# Altium schematic sheet Phase Shifting Stage.SchDoc
size A4; SheetNumber: 3; SheetTotal: 7
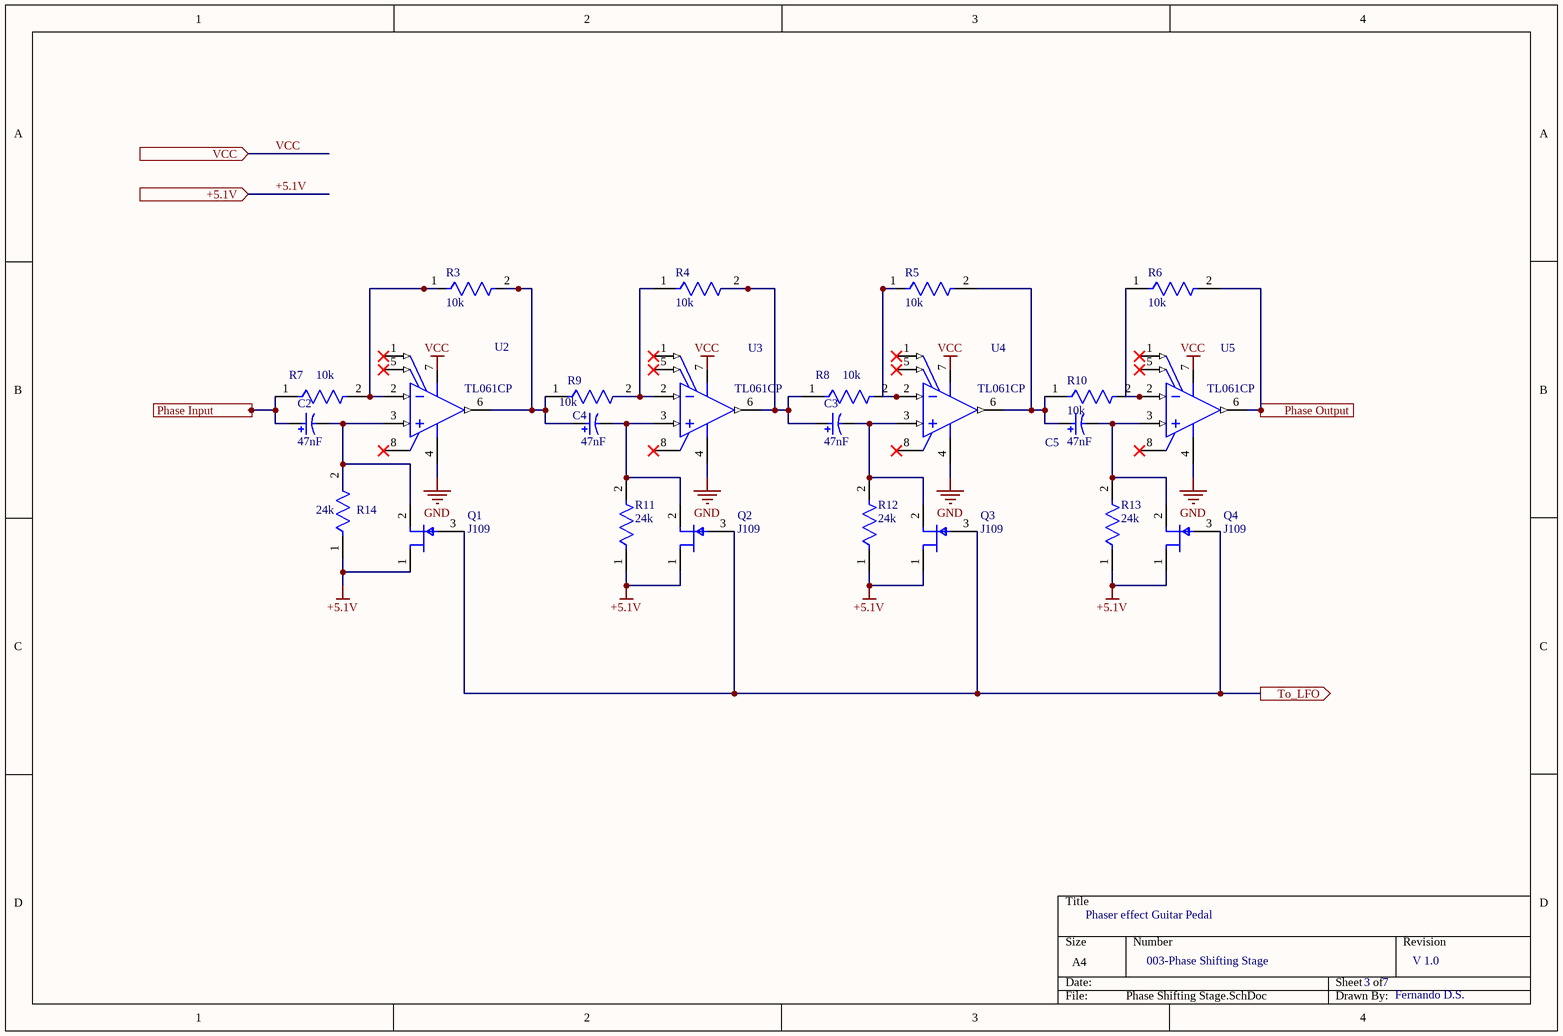
[diagram p0: Phase Shifting Stage.SchDoc]

## Parts
C2  47nF  [NIC-PLF-10x13-2_V]
C3  47nF  [NIC-PLF-10x13-2_V]
C4  47nF  [NIC-PLF-10x13-2_V]
C5  47nF  [NIC-PLF-10x13-2_V]
Q1  J109  [FP-135AN-MFG]
Q2  J109  [FP-135AN-MFG]
Q3  J109  [FP-135AN-MFG]
Q4  J109  [FP-135AN-MFG]
R3  10k  [FP-MRS25-MFG]
R4  10k  [FP-MRS25-MFG]
R5  10k  [FP-MRS25-MFG]
R6  10k  [FP-MRS25-MFG]
R7  10k  [FP-MRS25-MFG]
R8  10k  [FP-MRS25-MFG]
R9  10k  [FP-MRS25-MFG]
R10  10k  [FP-MRS25-MFG]
R11  24k  [FP-MRS25-MFG]
R12  24k  [FP-MRS25-MFG]
R13  24k  [FP-MRS25-MFG]
R14  24k  [FP-MRS25-MFG]
U2  TL061CP  [P0008A]
U3  TL061CP  [P0008A]
U4  TL061CP  [P0008A]
U5  TL061CP  [P0008A]

## Ports
+5.1V (in, see Main[3B], Input Buffer[1A], LFO[1A], Output Mixer[1A], Power supply[3B]), Phase Input (in, see Main[3B]), Phase Output (out, see Main[3B]), To_LFO (out, see Main[3B]), VCC (in, see Main[3B], Input Buffer[1A], LFO[1A], Power supply[3A], Selection[1A])

## Nets
+5.1V: Q1.1(D) Q2.1(D) Q3.1(D) Q4.1(D) R11.1 R12.1 R13.1 R14.1 ; port +5.1V
GND: U2.4(VCC-) U3.4(VCC-) U4.4(VCC-) U5.4(VCC-)
VCC: port VCC
Phase Input: C2.1 R7.1 ; port Phase Input
Phase Output: R6.2 U5.6(OUT) ; port Phase Output
To_LFO: Q1.3(G) Q2.3(G) Q3.3(G) Q4.3(G) ; port To_LFO
NetC2_2: C2.2 Q1.2(S) R14.2 U2.3(IN+)
NetC3_1: C3.1 R4.2 R8.1 U3.6(OUT)
NetC3_2: C3.2 Q3.2(S) R12.2 U4.3(IN+)
NetC4_1: C4.1 R3.2 R9.1 U2.6(OUT)
NetC4_2: C4.2 Q2.2(S) R11.2 U3.3(IN+)
NetC5_1: C5.1 R5.2 R10.1 U4.6(OUT)
NetC5_2: C5.2 Q4.2(S) R13.2 U5.3(IN+)
NetR3_1: R3.1 R7.2 U2.2(IN-)
NetR4_1: R4.1 R9.2 U3.2(IN-)
NetR5_1: R5.1 R8.2 U4.2(IN-)
NetR6_1: R6.1 R10.2 U5.2(IN-)

Not connected (* = marked no-connect by the designer): U2 1(OFFSET_N1)* 5(OFFSET_N2)* 7(VCC+) 8(NC)*; U3 1(OFFSET_N1)* 5(OFFSET_N2)* 7(VCC+) 8(NC)*; U4 1(OFFSET_N1)* 5(OFFSET_N2)* 7(VCC+) 8(NC)*; U5 1(OFFSET_N1)* 5(OFFSET_N2)* 7(VCC+) 8(NC)*

## Notes on the sheet
- Phaser effect Guitar Pedal
- 003-Phase Shifting Stage
- 3
- 7
- V 1.0
- Fernando D.S.
- Labels drawn without touching a wire or pin: VCC

## Library data of the parts
C2-C5 = CMP-1234-00001-1: Aluminum Electrolytic Capacitor, 470 uF +/-20%, 10 V, -55 to 105 degC, 2-Pin THD, RoHS; Manufacturer: Nichicon; PartNumber: PLF1A471MDO1; Leakage Current: 0.94 mA; Rated Ripple: 5700 mA; Rated Voltage: 10 V; Rated Capacitance: 470 uF; ComponentLink3URL: http://nichicon-us.com/english/products/pdfs/e-lf.pdf; PackageDescription: 2-Pin Through Hole Device, Dia 10 mm, Body Length 13 mm, Pin Spacing 5 mm; ComponentLink2URL: http://nichicon-us.com/english/products/pdfs/e-lf.pdf; RoHS: TRUE; ComponentLink1URL: http://www.nichicon.co.jp/; ComponentLink2Description: Datasheet; Capacitance Tolerance: +/-20%; ComponentLink1Description: Manufacturer URL; Mounting Technology: Through Hole; ComponentLink3Description: Package Specification; Temperature Range: -55 to 105 degC; DatasheetVersion: Sep-13
Q1-Q4 = CMP-00278-84329197-1: J109 Fairchild Semiconductor J109JFET Transistor, Jfet, -25 V, 40 Ma, 6 V, TO-92, Jfet; Manufacturer Lifecycle Status: ACTIVE; Power Dissipation: 625mW; Voltage Rating (DC): 25V; Element Configuration: Single; Drain to Source Resistance: 12Ω; Continuous Drain Current (ID): 40mA; Gate to Source Voltage (Vgs): -25V; Weight: 201mg; Case/Package: TO-92; NexarPartId: 84329197; RoHS: Compliant; Min Operating Temperature: -55°C; Max Power Dissipation: 625mW; Lifecycle Status: Production; Length: 4.58mm; Lead Free: Lead Free; Current Rating: 40mA; Mount: Through Hole; REACH SVHC: No SVHC; Width: 3.86mm; Max Operating Temperature: 150°C; Packaging: Bulk; Breakdown Voltage: -25V; Drain to Source Voltage (Vdss): 25V; Number of Pins: 3; Height: 4.58mm
R3-R14 = CMP-00030-42757237-1: MRS25000C1000FRP00 Resistor, 100 Ohm, ± 1%, 600 mW, Axial Leaded, Metal Film (Thin Film), Professional; Max Power Dissipation: 600mW; Resistance: 100Ω; Voltage Rating: 350V; Temperature Coefficient: 50ppm/°C; Lead Diameter: 600µm; RoHS: Compliant; Radiation Hardening: No; Schedule B: 8533210090, 8533210090; Length: 6.5mm; Packaging: Tape & Reel (TR); Number of Terminations: 2; Mount: Through Hole; Width: 2.5mm; Tolerance: 1%; Military Standard: Not; Voltage Rating (DC): 350V; Contact Plating: Tin; Number of Pins: 2; Max Operating Temperature: 155°C; NexarPartId: 42757237; Diameter: 2.5mm; Composition: Metal Film, Thin Film; REACH SVHC: Unknown; Power Rating: 600mW; Lead Free: Lead Free; Termination: Axial; Case/Package: Axial; Min Operating Temperature: -55°C
U2-U5 = CMP-0017-01052-2: Low-Power JFET-Input General-Purpose Operational Amplifier, 7 to 36 V, 0 to 70 degC, 8-pin DIP (P8), Pb-Free (RoHS); Manufacturer: Texas Instruments; CMRR(Min)(dB): 70; Offset Drift(Typ)(uV/C): 10; Vio (25C)(Max)(mV): 15; Rating: Military; Total Supply Voltage(Min)(+5V is 5, +/-5V is 10): 7; Vn at 1kHz(Typ)(nV/rtHz): 42; GBW(Typ)(MHz): 1; Total Supply Voltage(Max)(+5V is 5, +/-5V is 10): 36; Sub Family: General Purpose Amplifier, High Supply Voltage Amplifier (>=30V), Low Power Amp (<=500uA); Slew Rate(Typ)(V/us): 3.5; Iq per channel(Max)(mA): 0.25; IIB(Max)(pA): 400; ComponentLink2URL: http://www.ti.com/lit/ds/symlink/tl061.pdf; Mounting Technology: Through Hole; Code_JEDEC: MS-001; PackageVersion: 4040082/E, 04/2010; ComponentLink1URL: http://www.ti.com/; PartNumber: TL061CP; PackageReference: P0008A; ComponentLink1Description: Manufacturer URL; Eco-Plan: Pb-Free (RoHS); ComponentLink3URL: http://www.ti.com/litv/pdf/mpdi001b; Number of Channels: 1; DatasheetVersion: SLOS078J; ComponentLink3Description: Package Specification; PackageDescription: 8-Pin Plastic In-Line, Body 9.59 x 6.35 mm, Pitch 2.54 mm; ComponentLink2Description: Datasheet